# Altium schematic sheet 8P con. SCH.schdoc
size 124 x 99 mm
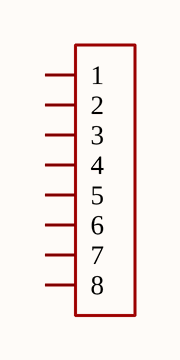
[diagram p0: 8P con. SCH.schdoc]

## Parts
P?  2.54-1*8P母环保  [HDR-TH_8P-P2.54-V-F-1]  (value not drawn)

## Nets

Not connected (* = marked no-connect by the designer): P? 1 2 3 4 5 6 7 8

## Library data of the parts
P? = 2.54-1*8P母环保: Manufacturer: BOOMELE(博穆精密); Symbol: Header-Female-2.54_1x8; Add into BOM: yes; Holes Structure: 1x8P; Pitch: 2.54mm; Number of Holes: 8P; Device: 2.54-1*8P母环保; LCSC Part Name: 间距:2.54mm 1x8P 直插; Supplier Part: C27438; Manufacturer Part: 2.54-1*8P母环保; Supplier Footprint: 插件,P=2.54mm; JLCPCB Part Class: Extended Part; Datasheet: https://atta.szlcsc.com/upload/public/pdf/source/20231221/1CA800C6799ED97958773716FAA1BFFE.pdf; Supplier: LCSC; Convert to PCB: yes; Row Spacing: -; Mounting Type: Straight; Number of Rows: Plugin; Insulation Height: -; Contact Material: -; Contact Plating: -